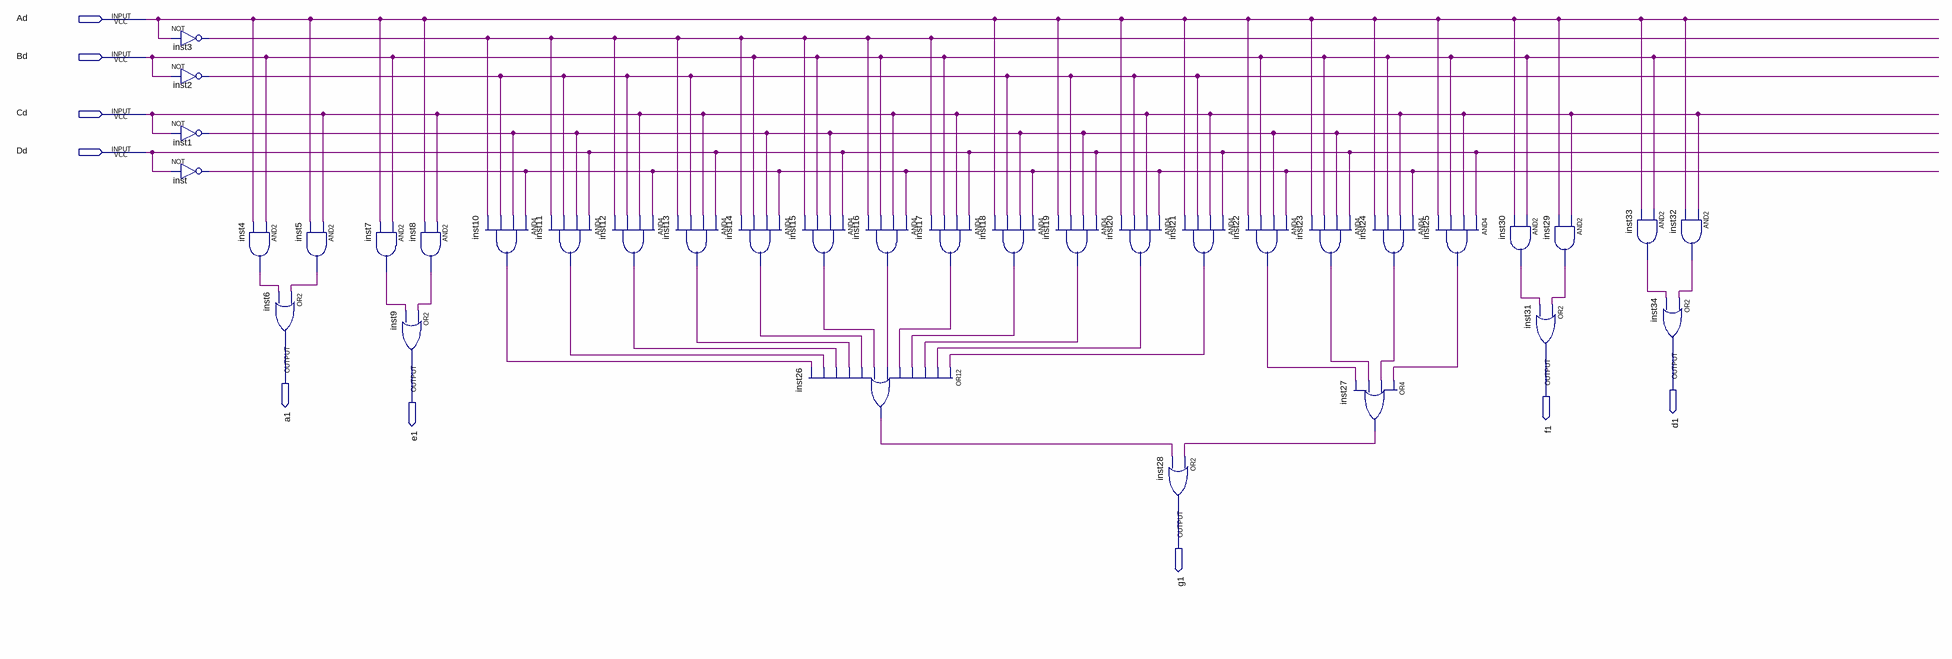
[diagram p0: schematic sheet]
// Quartus schematic dezena.bdf as structural Verilog: 35 symbols, 9 pins
module dezena (
  input  Ad,
  input  Bd,
  input  Cd,
  input  Dd,
  output a1,
  output d1,
  output f1,
  output e1,
  output g1
);

  wire inst1_out, inst2_out, inst3_out, inst4_out, inst5_out, inst7_out, inst8_out, inst10_out, inst11_out,
       inst12_out, inst13_out, inst14_out, inst15_out, inst16_out, inst17_out, inst18_out, inst19_out,
       inst20_out, inst21_out, inst22_out, inst23_out, inst24_out, inst25_out, inst26_out, inst27_out,
       inst29_out, inst30_out, inst32_out, inst33_out, inst_out;

  not inst3 (inst3_out, Ad);
  not inst2 (inst2_out, Bd);
  not inst1 (inst1_out, Cd);
  not inst (inst_out, Dd);
  and inst4 (inst4_out, Bd, Ad);
  and inst5 (inst5_out, Cd, Ad);
  or inst6 (a1, inst5_out, inst4_out);
  and inst7 (inst7_out, Bd, Ad);
  or inst9 (e1, inst8_out, inst7_out);
  and inst8 (inst8_out, Cd, Ad);
  and inst10 (inst10_out, inst_out, inst1_out, inst2_out, inst3_out);
  and inst11 (inst11_out, Dd, inst1_out, inst2_out, inst3_out);
  and inst12 (inst12_out, inst_out, Cd, inst2_out, inst3_out);
  and inst13 (inst13_out, Dd, Cd, inst2_out, inst3_out);
  and inst14 (inst14_out, inst_out, inst1_out, Bd, inst3_out);
  and inst15 (inst15_out, Dd, inst1_out, Bd, inst3_out);
  or inst26 (inst26_out, inst21_out, inst20_out, inst19_out, inst18_out, inst17_out, inst16_out, inst15_out, inst14_out, inst13_out, inst12_out, inst11_out, inst10_out);
  and inst16 (inst16_out, inst_out, Cd, Bd, inst3_out);
  and inst17 (inst17_out, Dd, Cd, Bd, inst3_out);
  and inst18 (inst18_out, inst_out, inst1_out, inst2_out, Ad);
  and inst19 (inst19_out, Dd, inst1_out, inst2_out, Ad);
  and inst20 (inst20_out, inst_out, Cd, inst2_out, Ad);
  or inst28 (g1, inst27_out, inst26_out);
  and inst21 (inst21_out, Dd, Cd, inst2_out, Ad);
  and inst22 (inst22_out, inst_out, inst1_out, Bd, Ad);
  and inst23 (inst23_out, Dd, inst1_out, Bd, Ad);
  and inst24 (inst24_out, inst_out, Cd, Bd, Ad);
  or inst27 (inst27_out, inst25_out, inst24_out, inst23_out, inst22_out);
  and inst25 (inst25_out, Dd, Cd, Bd, Ad);
  and inst30 (inst30_out, Bd, Ad);
  and inst29 (inst29_out, Cd, Ad);
  or inst31 (f1, inst29_out, inst30_out);
  and inst32 (inst32_out, Cd, Ad);
  and inst33 (inst33_out, Bd, Ad);
  or inst34 (d1, inst32_out, inst33_out);
endmodule
